# EAGLE schematic GRUBswitch_CustomHW_RevB (EAGLE 9.6.2)
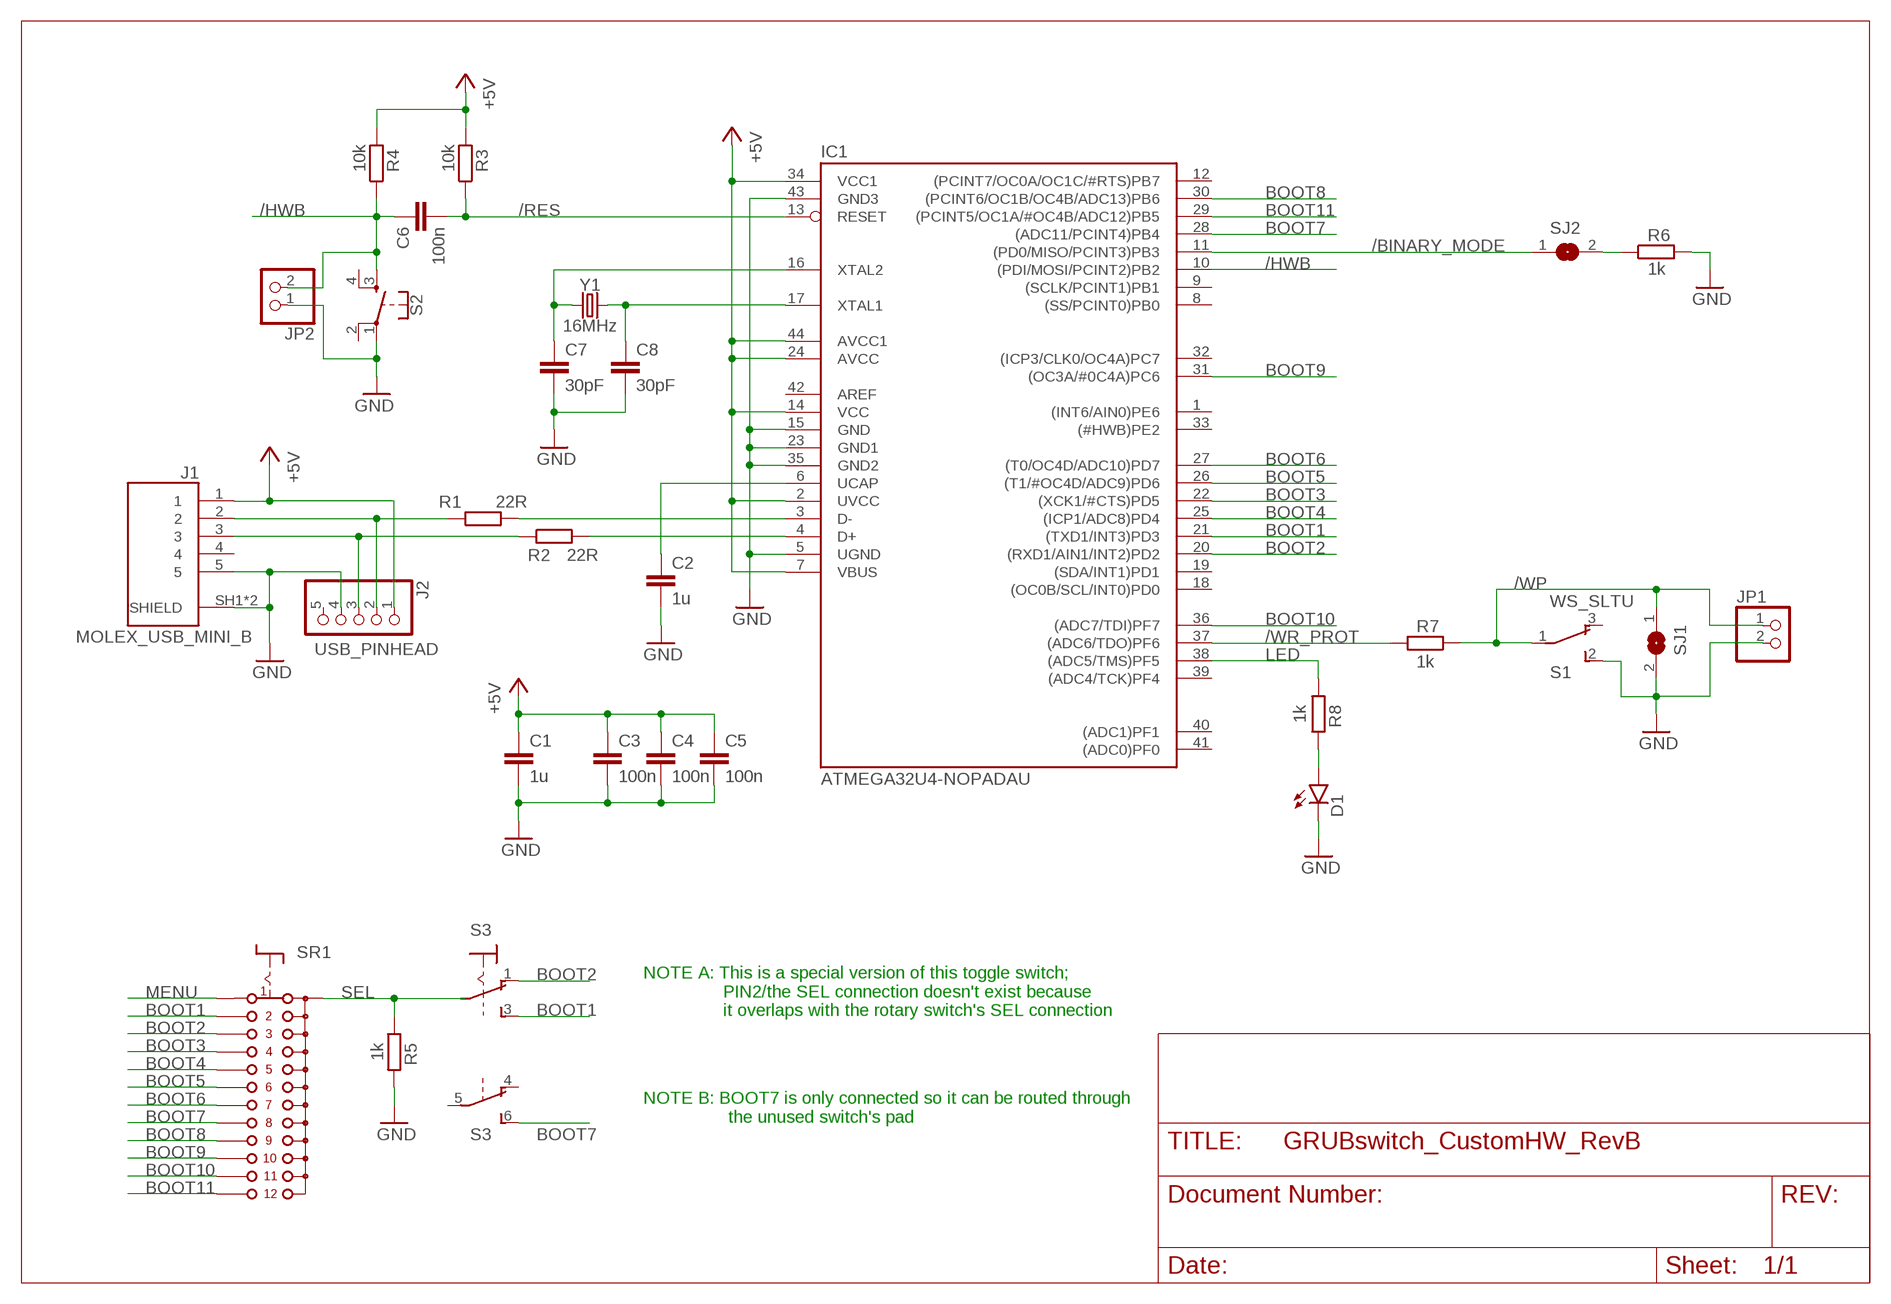
[diagram p0: schematic, sheet 1]

## Parts
C1  1u  C-EUC0805  [C0805]
C2  1u  C-EUC0805  [C0805]
C3  100n  C-EUC0805  [C0805]
C4  100n  C-EUC0805  [C0805]
C5  100n  C-EUC0805  [C0805]
C6  100n  C-EUC0805  [C0805]
C7  30pF  C-EUC0805  [C0805]
C8  30pF  C-EUC0805  [C0805]
D1  LEDCHIPLED_0805  [CHIPLED_0805]
IC1  ATMEGA32U4-NOPADAU  [TQFP44]
J1  MOLEX_USB_MINI_B  [MOLEX_502237-0517]
J2  USB_PINHEAD  PINHD-1X5  [1X05]
JP1  PINHD-1X2  [1X02]
JP2  PINHD-1X2  [1X02]
R1  22R  R-EU_R0805  [R0805]
R2  22R  R-EU_R0805  [R0805]
R3  10k  R-EU_R0805  [R0805]
R4  10k  R-EU_R0805  [R0805]
R5  1k  R-EU_R0805  [R0805]
R6  1k  R-EU_R0805  [R0805]
R7  1k  R-EU_R0805  [R0805]
R8  1k  R-EU_R0805  [R0805]
S1  WS_SLTU  [WS_SLTU]
S2  MOMENTARY-SWITCH-SPST-2-SMD-4.5MM  [TACTILE_SWITCH_SMD_4.5MM]
S3  M9040P2  [M9040P2]
SJ1  SJ  [SJ]
SJ2  SJ  [SJ]
SR1  CK101X12+  [CK101X12+]
Y1  16MHz  CRYSTALSMD-5X3.2-2PAD  [CRYSTAL-SMD-5X3.2-2PAD]

## Nets
+5V: C1.1 C3.1 C4.1 C5.1 IC1.2(UVCC) IC1.7(VBUS) IC1.14(VCC) IC1.24(AVCC) IC1.34(VCC1) IC1.44(AVCC1) J1.1 J2.1 R3.2 R4.2
/BINARY_MODE: IC1.11((PD0/MISO/PCINT3)PB3) SJ2.1
/BM: R6.1 SJ2.2
/HWB: C6.1 IC1.10((PDI/MOSI/PCINT2)PB2) JP2.2 R4.1 S2.3
/RES: C6.2 IC1.13(RESET) R3.1
/WP: JP1.1 R7.1 S1.1(P) SJ1.1
/WR_PROT: IC1.37((ADC6/TDO)PF6) R7.2
BOOT1: IC1.21((TXD1/INT3)PD3) S3.3(1:S) SR1.2
BOOT2: IC1.20((RXD1/AIN1/INT2)PD2) S3.1(1:O) SR1.3
BOOT3: IC1.22((XCK1/#CTS)PD5) SR1.4
BOOT4: IC1.25((ICP1/ADC8)PD4) SR1.5
BOOT5: IC1.26((T1/#OC4D/ADC9)PD6) SR1.6
BOOT6: IC1.27((T0/OC4D/ADC10)PD7) SR1.7
BOOT7: IC1.28((ADC11/PCINT4)PB4) S3.6(2:S) SR1.8
BOOT8: IC1.30((PCINT6/OC1B/OC4B/ADC13)PB6) SR1.9
BOOT9: IC1.31((OC3A/#0C4A)PC6) SR1.10
BOOT10: IC1.36((ADC7/TDI)PF7) SR1.11
BOOT11: IC1.29((PCINT5/OC1A/#OC4B/ADC12)PB5) SR1.12
D+: J1.3 J2.3 R2.1
D-: J1.2 J2.2 R1.1
GND: C1.2 C2.2 C3.2 C4.2 C5.2 C7.2 C8.2 D1.C IC1.5(UGND) IC1.15(GND) IC1.23(GND1) IC1.35(GND2) IC1.43(GND3) J1.5 J1.SH1(SHIELD) J1.SH2(SHIELD) J2.4 JP1.2 JP2.1 R5.2 R6.2 S1.2(S) S2.1 SJ1.2
LED: IC1.38((ADC5/TMS)PF5) R8.2
MENU: SR1.1
N$2: D1.A R8.1
R_D+: IC1.4(D+) R2.2
R_D-: IC1.3(D-) R1.2
SEL: R5.1 SR1.A
UCAP: C2.1 IC1.6(UCAP)
XTAL1: C8.1 IC1.17(XTAL1) Y1.P$2
XTAL2: C7.1 IC1.16(XTAL2) Y1.P$1
Unconnected: IC1.1((INT6/AIN0)PE6) IC1.8((SS/PCINT0)PB0) IC1.9((SCLK/PCINT1)PB1) IC1.12((PCINT7/OC0A/OC1C/#RTS)PB7) IC1.18((OC0B/SCL/INT0)PD0) IC1.19((SDA/INT1)PD1) IC1.32((ICP3/CLK0/OC4A)PC7) IC1.33((#HWB)PE2) IC1.39((ADC4/TCK)PF4) IC1.40((ADC1)PF1) IC1.41((ADC0)PF0) J1.4 J2.5 S1.3(O) S2.2 S2.4 S3.4(2:O) S3.5(2:P)

## Notes on the sheet
- NOTE A: This is a special version of this toggle switch;
                  PIN2/the SEL connection doesn't exist because
                  it overlaps with the rotary switch's SEL connection
- NOTE B: BOOT7 is only connected so it can be routed through
                   the unused switch's pad

## Power pins joined to a net without a drawn wire
AREF: IC1.42(AREF)

## Library data of the parts
C1-C8 = rcl:C-EU: CAPACITOR, European symbol; SPICEPREFIX: C
D1 = GRUB_Switch:LED: LED OSRAM: - CHIPLED LG R971, LG N971, LY N971, LG Q971, LY Q971, LO R971, LY R971 LH N974, LH R974 LS Q976, LO Q976, LY Q976 LO Q996 - Hyper CHIPLED LW Q18S LB Q993, LB Q99A, LB R99A - SideLED LS A670, LO A670, LY A670, LG A670, LP A670 LB A673, LV A673, LT A673, LW A673 LH A674 LY A675 LS A676, LA A676, LO A676, LY A676, LW A676 LS A679, LY A679, LG A679 - Hyper Micro SIDELED® LS Y876, LA Y876, LO Y876, LY Y876 LT Y87S - SmartLED LW L88C, LW L88S LB L89C, LB L89S, LG L890 LS L89K, LO L89K, LY L89K LS L896, LA L896, LO L896, LY L896 - TOPLED LS T670, LO T670, LY T670, LG T670, LP T670 LSG T670, LSP T670, LSY T670, LOP T670, LYG T670 LG T671, LOG T671, LSG T671 LB T673, LV T673, LT T673, LW T673 LH T674 LS T676, LA T676, LO T676, LY T676, LB T676, LH T676, LSB T676, LW T676 LB T67C, LV T67C, LT T67C, LS T67K, LO T67K, LY T67K, LW E67C LS E67B, LA E67B, LO E67B, LY E67B, LB E67C, LV E67C, LT E67C LW T67C LS T679, LY T679, LG T679 LS T770, LO T770, LY T770, LG T770, LP T770 LB T773, LV T773, LT T773, LW T773 LH T774 LS E675, LA E675, LY E675, LS T675 LS T776, LA T776, LO T776, LY T776, LB T776 LHGB T686 LT T68C, LB T68C - Hyper Mini TOPLED® LB M676 - Mini TOPLED Santana® LG M470 LS M47K, LO M47K, LY M47K Source: http://www.osram.convergy.de LUXEON: - LUMILED® LXK2-PW12-R00, LXK2-PW12-S00, LXK2-PW14-U00, LXK2-PW14-V00 LXK2-PM12-R00, LXK2-PM12-S00, LXK2-PM14-U00 LXK2-PE12-Q00, LXK2-PE12-R00, LXK2-PE12-S00, LXK2-PE14-T00, LXK2-PE14-U00 LXK2-PB12-K00, LXK2-PB12-L00, LXK2-PB12-M00, LXK2-PB14-N00, LXK2-PB14-P00, LXK2-PB14-Q00 LXK2-PR12-L00, LXK2-PR12-M00, LXK2-PR14-Q00, LXK2-PR14-R00 LXK2-PD12-Q00, LXK2-PD12-R00, LXK2-PD12-S00 LXK2-PH12-R00, LXK2-PH12-S00 LXK2-PL12-P00, LXK2-PL12-Q00, LXK2-PL12-R00 Source: www.luxeon.com KINGBRIGHT: KA-3528ASYC Source: www.kingbright.com
IC1 = GRUB_Switch:ATMEGA32U4-NOPAD
J1 = GRUB_Switch:MOLEX_USB_MINI_B: ZX Series 5 Position Right Angle PCB Wire Micro B USB Plug Check prices <https://pricing.snapeda.com/search/part/ZX62-B-5PA%2833%29/?ref=eda>
J2 = pinhead:PINHD-1X5: PIN HEADER
JP1 JP2 = pinhead:PINHD-1X2: PIN HEADER
R1-R8 = rcl:R-EU_: RESISTOR, European symbol; SPICEPREFIX: R
S1 = GRUB_Switch:WS_SLTU
S2 = GRUB_Switch:MOMENTARY-SWITCH-SPST-2: Momentary Switch (Pushbutton) - SPST - Two Circuits Normally-open (NO) SPST momentary switches (buttons, pushbuttons). Schematic symbol includes two switch circuits. Variants SMD-4.6MMX2.8MM - 4.60mm x 2.80mm Tactile Momentary Button Switch - Used on SparkFun SAMD21 Mini Breakout <https://www.sparkfun.com/products/13664> SMD-5.2MM - Mini Pushbutton Switch - SMD <https://www.sparkfun.com/products/8720> - Used on Arduino Pro Mini <https://www.sparkfun.com/products/11114>
S3 = GRUB_Switch:M9040P2: TOGGLE SWITCH Marquardt
SJ1 SJ2 = jumper:SJ: SMD solder JUMPER
SR1 = GRUB_Switch:CK101X12: ROTARY SWITCH C&K
Y1 = GRUB_Switch:CRYSTAL: Crystals (Generic) These are passive quartz crystals, which can be used as a clock source for a microcontroller. Crystal's are two-terminal devices. They require external "load" capacitors to generate an oscillating signal.